# Altium schematic sheet overview.SchDoc
size A4; SheetNumber: 1; SheetTotal: 4
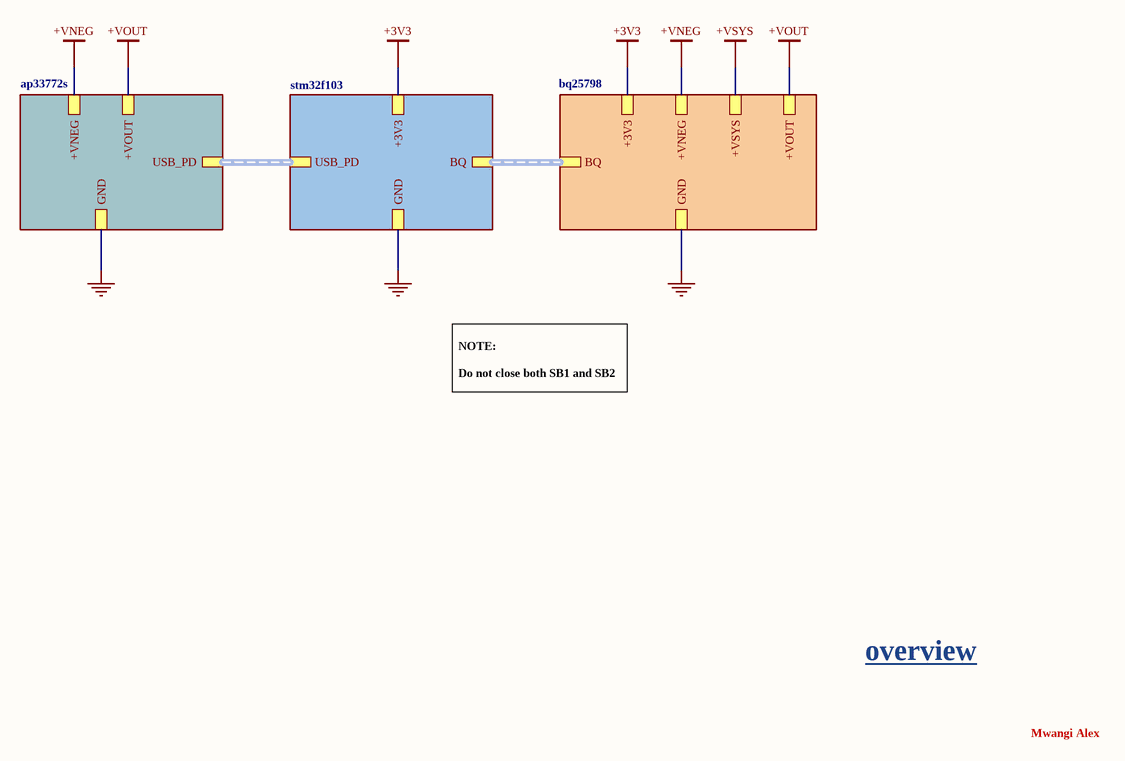
[diagram p0: overview.SchDoc]

## Sub-sheets
ap33772s = ap33772s.SchDoc: USB_PD (harness USB_PD), +VNEG, GND, +VOUT
bq25798 = bq25798.SchDoc: BQ (harness BQ_I2C), +VNEG, GND, +3V3, +VSYS, +VOUT
stm32f103 = stm32f103.SchDoc: USB_PD (harness USB_PD), +3V3, GND, BQ (harness BQ)

## Nets
+3V3: sheet stm32f103/+3V3, sheet bq25798/+3V3
+VNEG: sheet ap33772s/+VNEG, sheet bq25798/+VNEG
+VOUT: sheet ap33772s/+VOUT, sheet bq25798/+VOUT
+VSYS: sheet bq25798/+VSYS
GND: sheet ap33772s/GND, sheet stm32f103/GND, sheet bq25798/GND

## Buses and harness runs
harness sheet ap33772s/USB_PD = sheet stm32f103/USB_PD
harness sheet bq25798/BQ = sheet stm32f103/BQ

## Notes on the sheet
- NOTE:
  Do not close both SB1 and SB2
- overview
- Mwangi Alex